# EAGLE schematic Sparki_Rev15 (EAGLE 6.4)

## Sheet 1 of 2
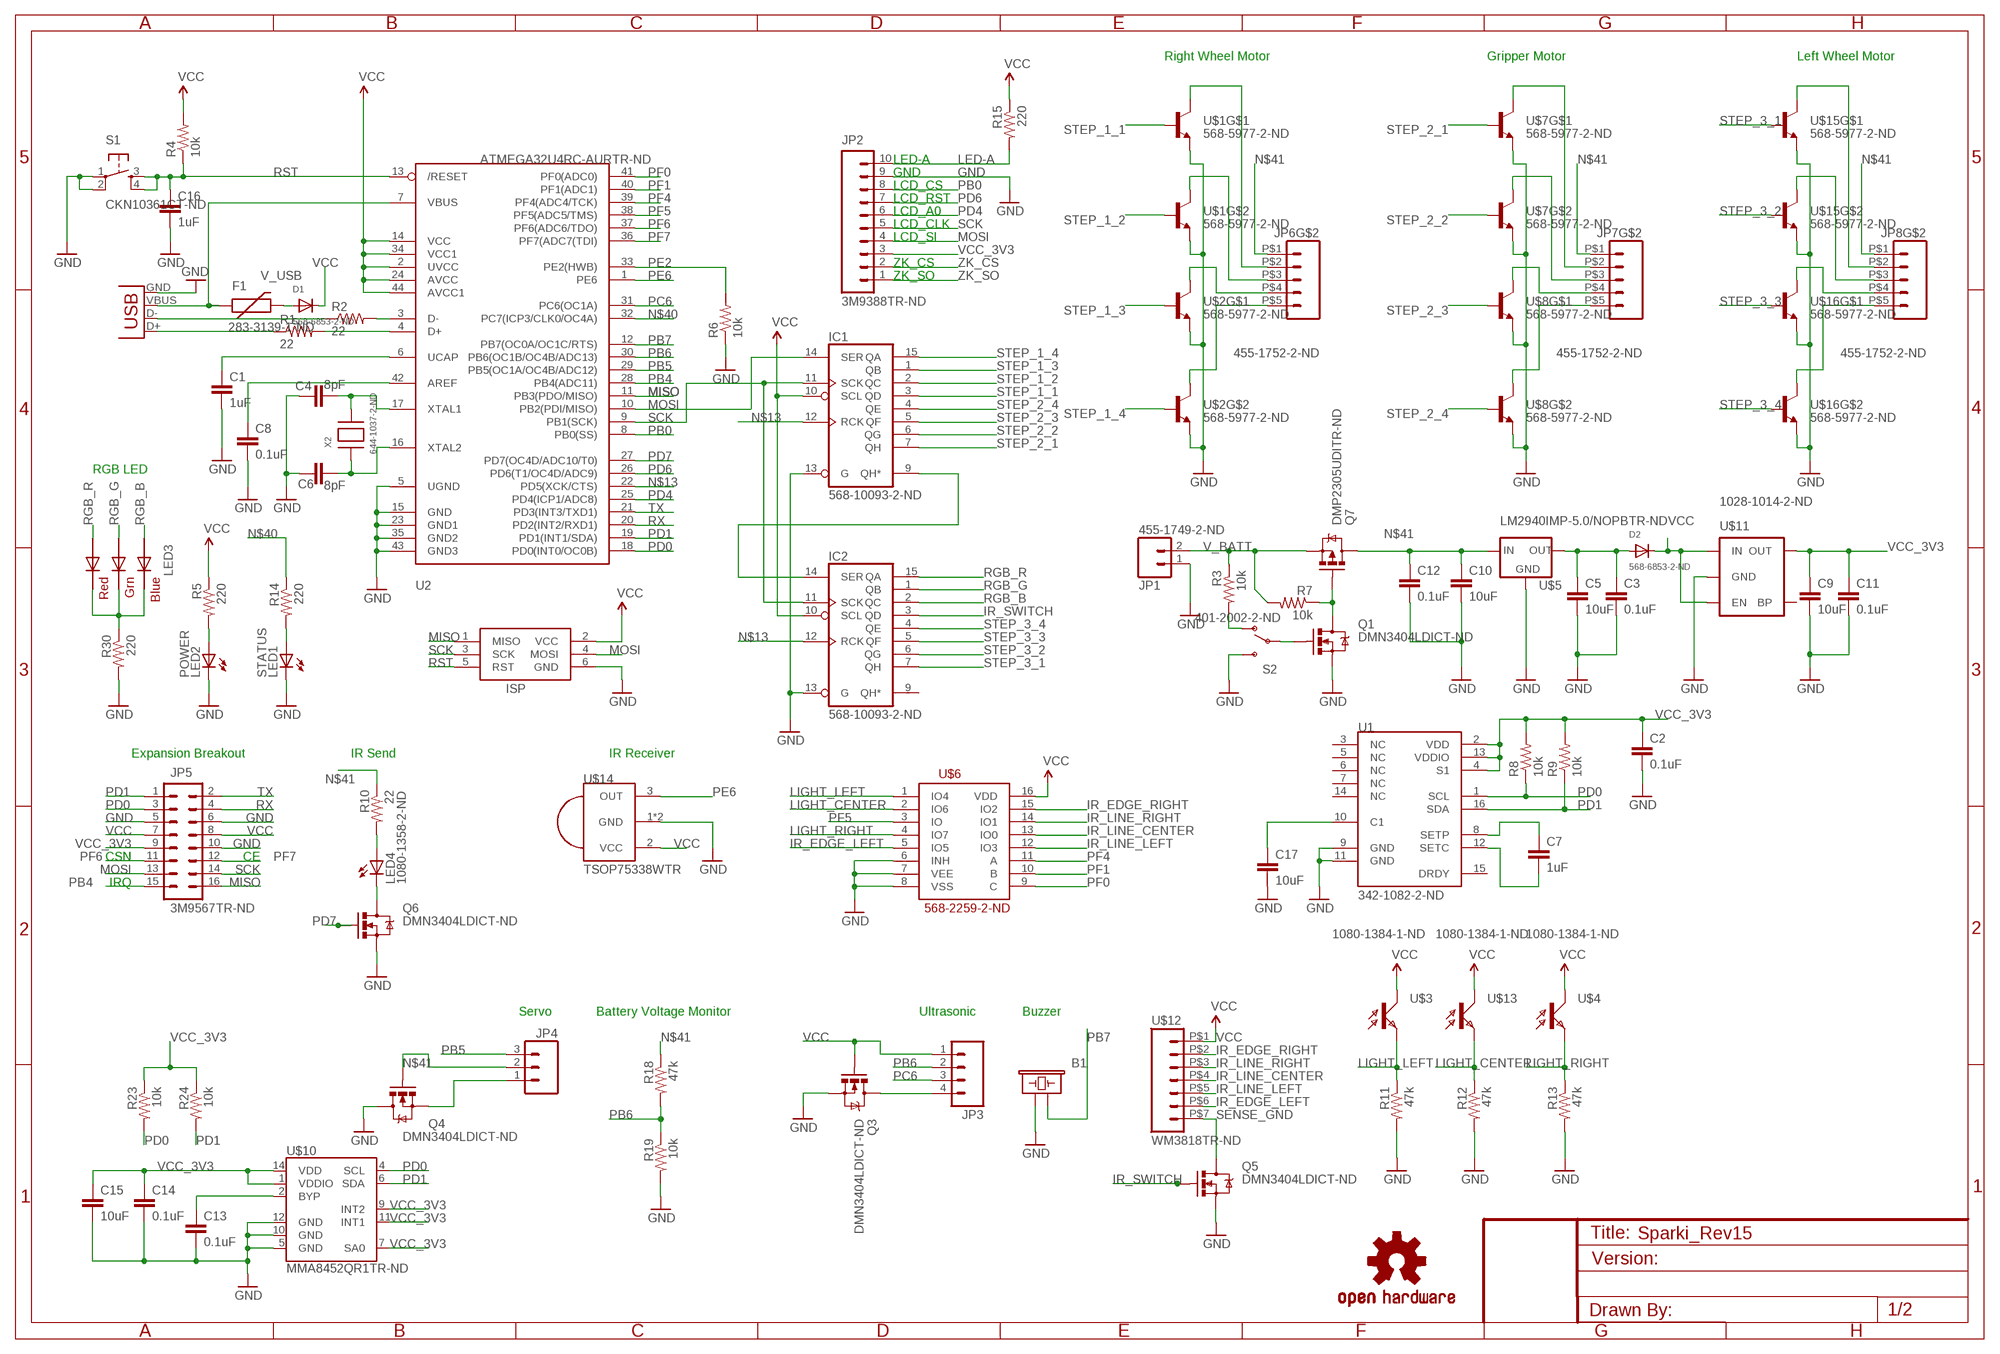
[diagram p0: schematic, sheet 1]

### Parts
B1  SMT-0927-T-2-R  BUZZERSMD2  [BUZZER-CCV]
C1  1uF  CAP0603-CAP  [0603-CAP]
C2  0.1uF  CAP0603-CAP  [0603-CAP]
C3  0.1uF  CAP0603-CAP  [0603-CAP]
C4  8pF  CAP0603-CAP  [0603-CAP]
C5  10uF  CAP0805  [0805]
C6  8pF  CAP0603-CAP  [0603-CAP]
C7  1uF  CAP0603-CAP  [0603-CAP]
C8  0.1uF  CAP0603-CAP  [0603-CAP]
C9  10uF  CAP0805  [0805]
C10  10uF  CAP0805  [0805]
C11  0.1uF  CAP0603-CAP  [0603-CAP]
C12  0.1uF  CAP0603-CAP  [0603-CAP]
C13  0.1uF  CAP0603-CAP  [0603-CAP]
C14  0.1uF  CAP0603-CAP  [0603-CAP]
C15  10uF  CAP0805  [0805]
C16  1uF  CAP0603-CAP  [0603-CAP]
C17  10uF  CAP0805  [0805]
D1  568-6853-2-ND  PMEG3010EP  [SOD-128]
D2  568-6853-2-ND  PMEG3010EP  [SOD-128]
F1  283-3139-1-ND  PTCSMD  [PTC-1206]
IC1  568-10093-2-ND  74595  [TSSOP16]
IC2  568-10093-2-ND  74595  [TSSOP16]
ISP  AVRISP-6  [AVRISP]
JP1  455-1749-2-ND  M02-JST-2MM-SMT  [JST-2-SMD]
JP2  3M9388TR-ND  M10  [1X10-2.54MM-SMD]
JP3  3M12031-ND  M04SMD3  [1X04-2.54MM-SMD]
JP4  M20-8900305-ND  M03SMD_RA_MALE  [1X03_SMD_RA_MALE]
JP5  3M9567TR-ND  M08X2SMD  [2X08-2.54MM-SMD]
JP6  455-1752-2-ND  JST-PH2.0-5P  [1X05-2.0MM-JST-PH]
JP7  455-1752-2-ND  JST-PH2.0-5P  [1X05-2.0MM-JST-PH]
JP8  455-1752-2-ND  JST-PH2.0-5P  [1X05-2.0MM-JST-PH]
LED1  STATUS  LEDSML0805  [SML0805]
LED2  POWER  LEDSML0805  [SML0805]
LED3  PLCC6RGBCT  RGBLED5050  [RGBLED5050]
LED4  1080-1358-2-ND  LED-FKIT-1206  [FKIT-LED-1206]
LOGO1  OSHW-LOGOM  [OSHW-LOGO-M]
Q1  DMN3404LDICT-ND  MOSFET-NCHANNELSMD  [SOT23-3]
Q3  DMN3404LDICT-ND  MOSFET-NCHANNELSMD  [SOT23-3]
Q4  DMN3404LDICT-ND  MOSFET-NCHANNELSMD  [SOT23-3]
Q5  DMN3404LDICT-ND  MOSFET-NCHANNELSMD  [SOT23-3]
Q6  DMN3404LDICT-ND  MOSFET-NCHANNELSMD  [SOT23-3]
Q7  DMP2305UDITR-ND  MOSFET-PCHANNELSMD  [SOT23-3]
R1  22  RESISTOR0603-RES  [0603-RES]
R2  22  RESISTOR0603-RES  [0603-RES]
R3  10k  RESISTOR0603-RES  [0603-RES]
R4  10k  RESISTOR0603-RES  [0603-RES]
R5  220  RESISTOR0603-RES  [0603-RES]
R6  10k  RESISTOR0603-RES  [0603-RES]
R7  10k  RESISTOR0603-RES  [0603-RES]
R8  10k  RESISTOR0603-RES  [0603-RES]
R9  10k  RESISTOR0603-RES  [0603-RES]
R10  22  RESISTOR0603-RES  [0603-RES]
R11  47k  RESISTOR0603-RES  [0603-RES]
R12  47k  RESISTOR0603-RES  [0603-RES]
R13  47k  RESISTOR0603-RES  [0603-RES]
R14  220  RESISTOR0603-RES  [0603-RES]
R15  220  RESISTOR0603-RES  [0603-RES]
R18  47k  RESISTOR0603-RES  [0603-RES]
R19  10k  RESISTOR0603-RES  [0603-RES]
R23  10k  RESISTOR0603-RES  [0603-RES]
R24  10k  RESISTOR0603-RES  [0603-RES]
R30  220  RESISTOR0603-RES  [0603-RES]
S1  CKN10361CT-ND  TAC_SWITCHSMD  [TACTILE_SWITCH_SMD]
S2  401-2002-2-ND  SWITCH-SPDTSMD  [AYZ0202]
U1  342-1082-2-ND  HMC5883LSMD  [16LPCC]
U2  ATMEGA32U4RC-AURTR-ND  ATMEGA32U4-AU  [TQFP44]
U$1  568-5977-2-ND  MMDT3904  [SOT363]
U$2  568-5977-2-ND  MMDT3904  [SOT363]
U$3  1080-1384-1-ND  PHOTOTRANSISTOR0402  [LED-0402]
U$4  1080-1384-1-ND  PHOTOTRANSISTOR0402  [LED-0402]
U$5  LM2940IMP-5.0/NOPBTR-ND  V_REG_MIC2920  [SOT223]
U$6  568-2259-2-ND  74HC4051_MUXTSSOP-16  [TSSOP-16]
U$7  568-5977-2-ND  MMDT3904  [SOT363]
U$8  568-5977-2-ND  MMDT3904  [SOT363]
U$10  MMA8452QR1TR-ND  MMA8452Q  [QFN-16_0.5MM]
U$11  1028-1014-2-ND  V_REG_LDOSMD  [SOT23-5]
U$12  WM3818TR-ND  FPC-1.0MM-7P  [1X07-1.0MM-FPC]
U$13  1080-1384-1-ND  PHOTOTRANSISTOR0402  [LED-0402]
U$14  TSOP75338WTR  TSOP75338  [TSOP75338]
U$15  568-5977-2-ND  MMDT3904  [SOT363]
U$16  568-5977-2-ND  MMDT3904  [SOT363]
X1  ED90342TR-ND  USBSMD  [USB-MINIB]
X2  644-1037-2-ND  XTALNX5032  [NX5032]

### Nets
ACCEL_BYP: C13.1 U$10.2(BYP)
D+: R1.2 U2.4(D+)
D-: R2.2 U2.3(D-)
GND: B1.- C1.2 C2.2 C3.2 C4.2 C5.2 C6.2 C8.2 C9.2 C10.2 C11.2 C12.2 C13.2 C14.2 C15.2 C16.2 C17.2 IC1.13(G) IC2.13(G) ISP.6(GND) JP1.1 JP2.9 JP5.5 JP5.6 JP5.10 LED1.C LED2.C Q1.2(S) Q3.2(S) Q4.3(D) Q5.2(S) Q6.2(S) R6.1 R11.2 R12.2 R13.2 R19.2 R30.2 S1.1 S1.2 S2.3(S) U1.9(GND) U1.11(GND) U2.5(UGND) U2.15(GND) U2.23(GND1) U2.35(GND2) U2.43(GND3) U$1.1(E) U$1.4(E) U$2.1(E) U$2.4(E) U$5.2(GND) U$6.6(INH) U$6.7(VEE) U$6.8(VSS) U$7.1(E) U$7.4(E) U$8.1(E) U$8.4(E) U$10.5(GND) U$10.10(GND) U$10.12(GND) U$11.2(GND) U$14.1(GND) U$14.4(GND) U$15.1(E) U$15.4(E) U$16.1(E) U$16.4(E) X1.GND
IR_EDGE_LEFT: U$6.5(IO5) U$12.P$6 ; also sheet 2
IR_EDGE_RIGHT: U$6.15(IO2) U$12.P$2 ; also sheet 2
IR_LINE_CENTER: U$6.13(IO0) U$12.P$4 ; also sheet 2
IR_LINE_LEFT: U$6.12(IO3) U$12.P$5 ; also sheet 2
IR_LINE_RIGHT: U$6.14(IO1) U$12.P$3 ; also sheet 2
IR_SWITCH: IC2.3(QD) Q5.1(G)
IRSEND: LED4.A R10.2
LED-A: JP2.10 R15.2
LIGHT_CENTER: R12.1 U$6.2(IO6) U$13.2(E)
LIGHT_LEFT: R11.1 U$3.2(E) U$6.1(IO4)
LIGHT_RIGHT: R13.1 U$4.2(E) U$6.4(IO7)
MISO: ISP.1(MISO) JP5.16 U2.11(PB3(PDO/MISO))
MOSI: IC1.14(SER) ISP.4(MOSI) JP2.4 JP5.13 U2.10(PB2(PDI/MISO))
N$2: LED2.A R5.2
N$3: JP7.P$2 U$7.3(C)
N$4: R2.1 X1.D-
N$5: R1.1 X1.D+
N$6: Q1.3(D) Q7.1(G) R7.1
N$7: JP6.P$5 U$2.6(C)
N$8: Q1.1(G) S2.2(P)
N$9: C3.1 C5.1 D2.P$2(A) U$5.3(OUT)
N$10: JP6.P$4 U$2.3(C)
N$12: JP6.P$3 U$1.6(C)
N$13: IC1.12(RCK) IC2.12(RCK) U2.22(PD5(XCK/CTS))
N$14: JP8.P$4 U$16.3(C)
N$15: JP8.P$3 U$15.6(C)
N$16: JP8.P$2 U$15.3(C)
N$17: IC1.9(QH*) IC2.14(SER)
N$18: LED4.C Q6.3(D)
N$19: LED1.A R14.2
N$20: C7.1 U1.8(SETP)
N$21: JP6.P$2 U$1.3(C)
N$23: JP3.4 Q3.3(D)
N$24: R3.2 S2.1(O)
N$25: JP4.1 Q4.2(S)
N$27: C7.2 U1.12(SETC)
N$28: C17.1 U1.10(C1)
N$29: C8.1 U2.42(AREF)
N$30: JP7.P$5 U$8.6(C)
N$31: JP7.P$4 U$8.3(C)
N$32: JP7.P$3 U$7.6(C)
N$40: R14.1 U2.32(PC7(ICP3/CLK0/OC4A))
N$41: C10.1 C12.1 JP4.2 JP6.P$1 JP7.P$1 JP8.P$1 Q4.1(G) Q7.3(D) R10.1 R18.1 U$5.1(IN)
N$42: LED3.4(BLUE_C) LED3.5(RED_C) LED3.6(GREEN_C) R30.1
N$44: JP8.P$5 U$16.6(C)
PB0: JP2.8 U2.8(PB0(SS))
PB4: JP5.15 U2.28(PB4(ADC11))
PB5: JP4.3 U2.29(PB5(OC1A/OC4B/ADC12))
PB6: JP3.2 R18.2 R19.1 U2.30(PB6(OC1B/OC4B/ADC13))
PB7: B1.+ U2.12(PB7(OC0A/OC1C/RTS))
PC6: JP3.3 U2.31(PC6(OC1A))
PD0: JP5.3 R8.1 R23.2 U1.1(SCL) U2.18(PD0(INT0/OC0B)) U$10.4(SCL)
PD1: JP5.1 R9.1 R24.2 U1.16(SDA) U2.19(PD1(INT1/SDA)) U$10.6(SDA)
PD4: JP2.6 U2.25(PD4(ICP1/ADC8))
PD6: JP2.7 U2.26(PD6(T1/OC4D/ADC9))
PD7: Q6.1(G) U2.27(PD7(OC4D/ADC10/T0))
PE2: R6.2 U2.33(PE2(HWB))
PE6: U2.1(PE6) U$14.3(OUT)
PF0: U2.41(PF0(ADC0)) U$6.9(C)
PF1: U2.40(PF1(ADC1)) U$6.10(B)
PF4: U2.39(PF4(ADC4/TCK)) U$6.11(A)
PF5: U2.38(PF5(ADC5/TMS)) U$6.3(IO)
PF6: JP5.11 U2.37(PF6(ADC6/TDO))
PF7: JP5.12 U2.36(PF7(ADC7(TDI))
RGB_B: IC2.2(QC) LED3.3(BLUE_A)
RGB_G: IC2.1(QB) LED3.1(GREEN_A)
RGB_R: IC2.15(QA) LED3.2(RED_A)
RST: C16.1 ISP.5(RST) R4.1 S1.3 S1.4 U2.13(/RESET)
RX: JP5.4 U2.20(PD2(INT2/RXD1))
SCK: IC1.11(SCK) IC2.11(SCK) ISP.3(SCK) JP2.5 JP5.14 U2.9(PB1(SCK))
SENSE_GND: Q5.3(D) U$12.P$7 ; also sheet 2
STEP_1_1: IC1.3(QD) U$1.5(B)
STEP_1_2: IC1.2(QC) U$1.2(B)
STEP_1_3: IC1.1(QB) U$2.5(B)
STEP_1_4: IC1.15(QA) U$2.2(B)
STEP_2_1: IC1.7(QH) U$7.5(B)
STEP_2_2: IC1.6(QG) U$7.2(B)
STEP_2_3: IC1.5(QF) U$8.5(B)
STEP_2_4: IC1.4(QE) U$8.2(B)
STEP_3_1: IC2.7(QH) U$15.5(B)
STEP_3_2: IC2.6(QG) U$15.2(B)
STEP_3_3: IC2.5(QF) U$16.5(B)
STEP_3_4: IC2.4(QE) U$16.2(B)
TX: JP5.2 U2.21(PD3(INT3/TXD1))
UCAP: C1.1 U2.6(UCAP)
V_BATT: JP1.2 Q7.2(S) R3.1 R7.2
V_USB: D1.P$2(A) F1.2
VBUS: F1.1 U2.7(VBUS) X1.VBUS
VCC: D1.P$1(C) D2.P$1(C) IC1.10(SCL) IC2.10(SCL) ISP.2(VCC) JP3.1 JP5.7 JP5.8 Q3.1(G) R4.2 R5.1 R15.1 U2.2(UVCC) U2.14(VCC) U2.24(AVCC) U2.34(VCC1) U2.44(AVCC1) U$3.1(C) U$4.1(C) U$6.16(VDD) U$11.1(IN) U$11.3(EN) U$12.P$1 U$13.1(C) U$14.2(VCC) ; also sheet 2
VCC_3V3: C2.1 C9.1 C11.1 C14.1 C15.1 JP2.3 JP5.9 R8.2 R9.2 R23.1 R24.1 U1.2(VDD) U1.4(S1) U1.13(VDDIO) U$10.1(VDDIO) U$10.7(SA0) U$10.9(INT2) U$10.11(INT1) U$10.14(VDD) U$11.5(OUT)
XTAL1: C4.1 U2.17(XTAL1) X2.P$2
XTAL2: C6.1 U2.16(XTAL2) X2.P$1
ZK_CS: JP2.2
ZK_SO: JP2.1
Unconnected: IC2.9(QH*) U1.3(NC) U1.5(NC) U1.6(NC) U1.7(NC) U1.14(NC) U1.15(DRDY) U$11.4(BP)

### Notes on the sheet
- Right Wheel Motor | Gripper Motor | Left Wheel Motor
- LED-A
- GND
- LCD_CS
- LCD_RST
- LCD_A0
- LCD_CLK
- LCD_SI
- ZK_CS
- ZK_SO
- RGB LED
- Expansion Breakout | IR Send | IR Receiver
- CSN | CE
- IRQ
- Servo | Battery Voltage Monitor | Ultrasonic | Buzzer

## Sheet 2 of 2
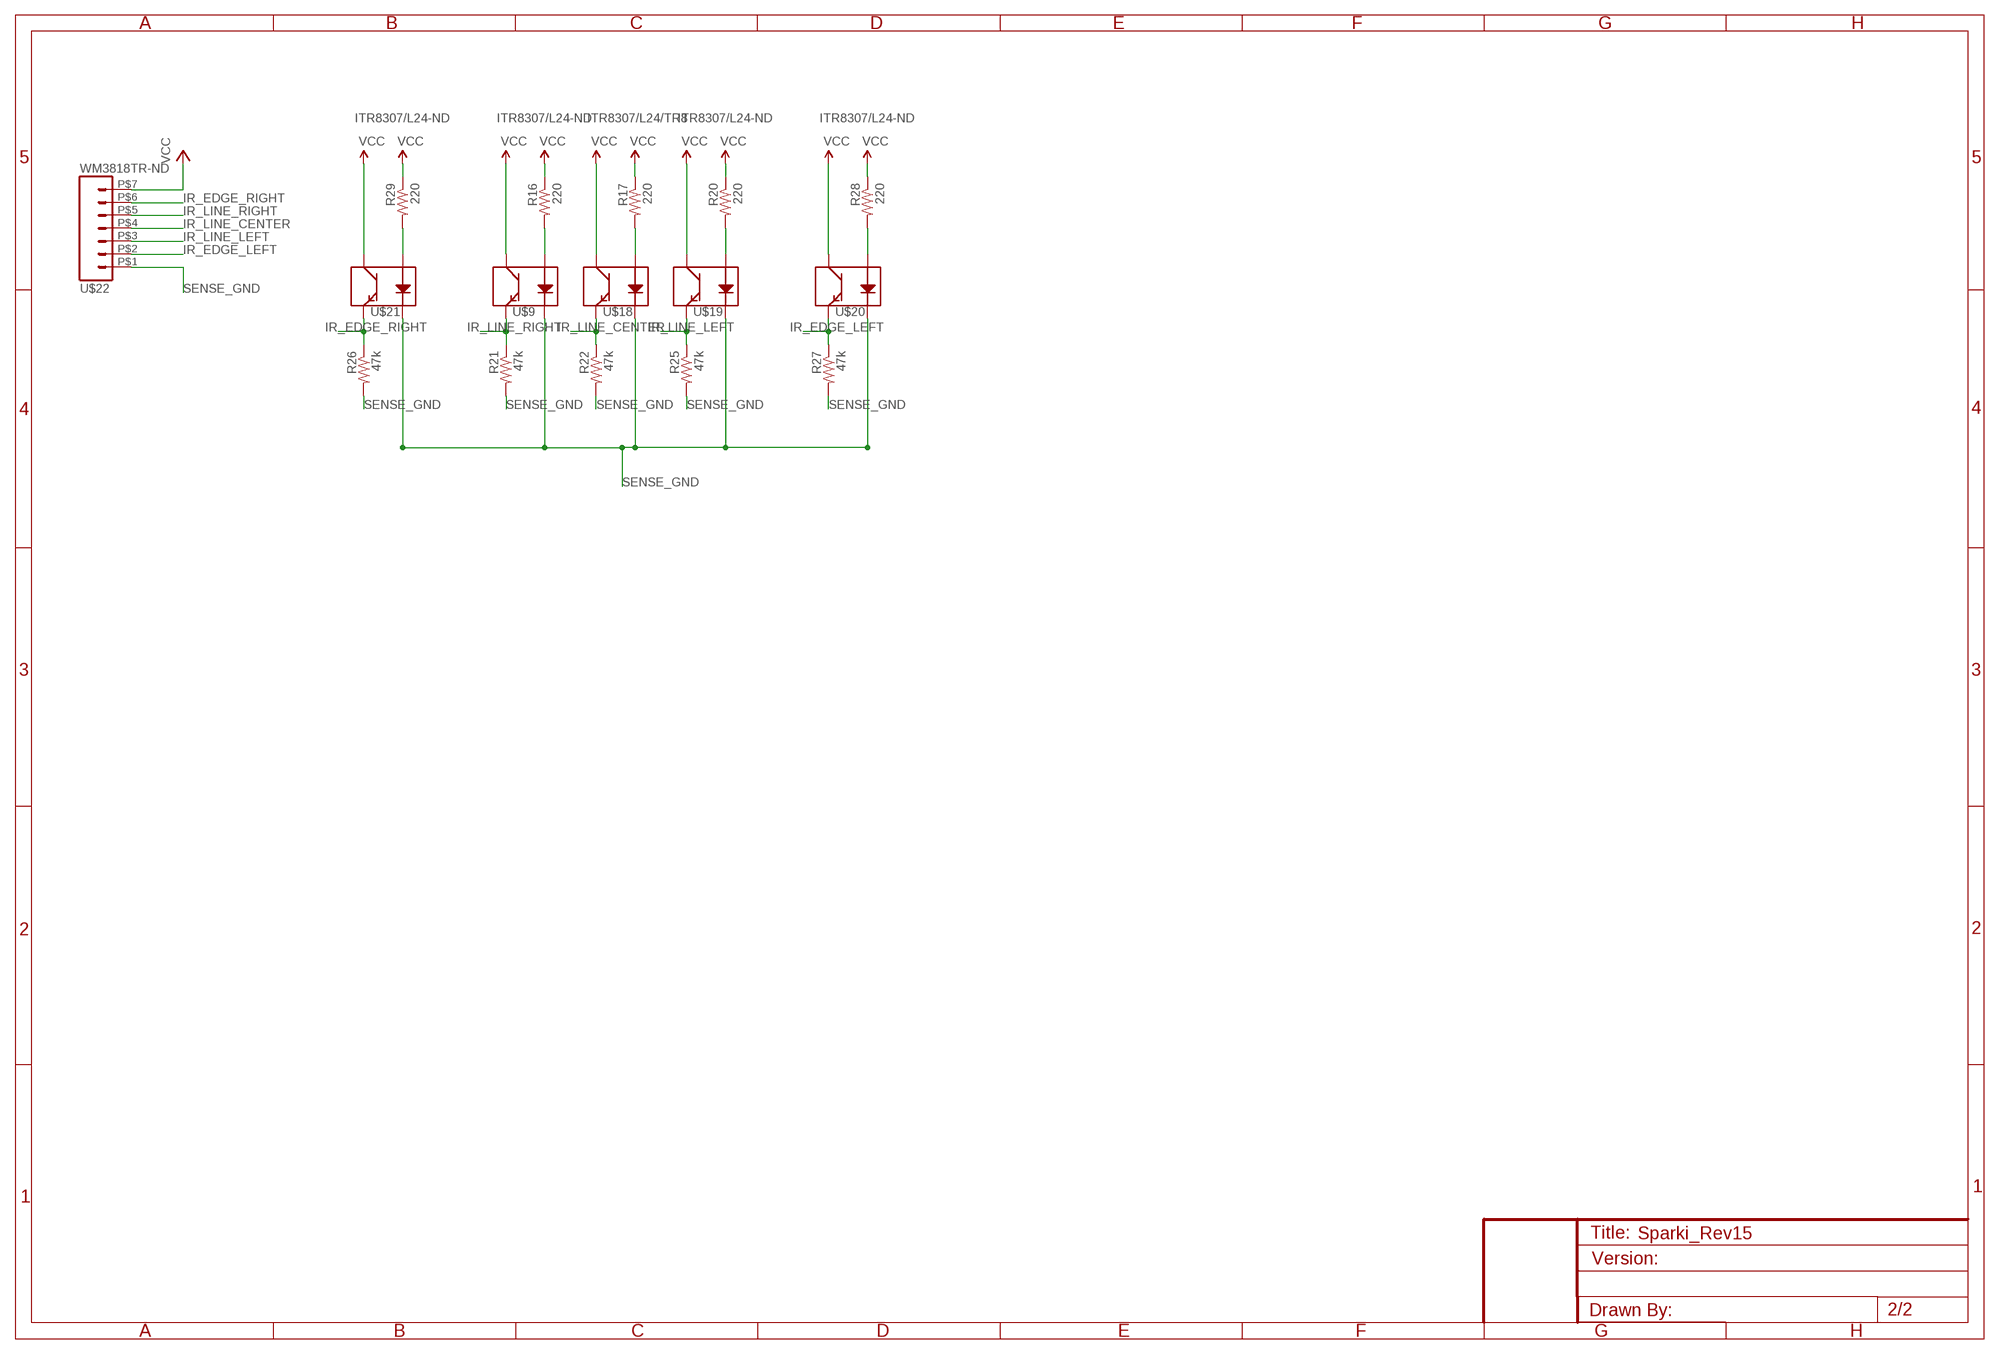
[diagram p1: schematic, sheet 2]

### Parts
R16  220  RESISTOR0603-RES  [0603-RES]
R17  220  RESISTOR0603-RES  [0603-RES]
R20  220  RESISTOR0603-RES  [0603-RES]
R21  47k  RESISTOR0603-RES  [0603-RES]
R22  47k  RESISTOR0603-RES  [0603-RES]
R25  47k  RESISTOR0603-RES  [0603-RES]
R26  47k  RESISTOR0603-RES  [0603-RES]
R27  47k  RESISTOR0603-RES  [0603-RES]
R28  220  RESISTOR0603-RES  [0603-RES]
R29  220  RESISTOR0603-RES  [0603-RES]
U$9  ITR8307/L24-ND  QRE1113  [QRE1113]
U$18  ITR8307/L24/TR8  QRE1113  [QRE1113]
U$19  ITR8307/L24-ND  QRE1113  [QRE1113]
U$20  ITR8307/L24-ND  QRE1113  [QRE1113]
U$21  ITR8307/L24-ND  QRE1113  [QRE1113]
U$22  WM3818TR-ND  FPC-1.0MM-7P  [1X07-1.0MM-FPC]

### Nets
IR_EDGE_LEFT: R27.1 U$20.4(E) U$22.P$2 ; also sheet 1
IR_EDGE_RIGHT: R26.1 U$21.4(E) U$22.P$6 ; also sheet 1
IR_LINE_CENTER: R22.1 U$18.4(E) U$22.P$4 ; also sheet 1
IR_LINE_LEFT: R25.1 U$19.4(E) U$22.P$3 ; also sheet 1
IR_LINE_RIGHT: R21.1 U$9.4(E) U$22.P$5 ; also sheet 1
LINEFLEDLEFT: R16.2 U$9.1(A)
LINEFLEDMID: R17.2 U$18.1(A)
LINEFLEDRIGHT: R20.2 U$19.1(A)
N$36: R28.2 U$20.1(A)
N$37: R29.2 U$21.1(A)
SENSE_GND: R21.2 R22.2 R25.2 R26.2 R27.2 U$9.2(K) U$18.2(K) U$19.2(K) U$20.2(K) U$21.2(K) U$22.P$1 ; also sheet 1
VCC: R16.1 R17.1 R20.1 R28.1 R29.1 U$9.3(C) U$18.3(C) U$19.3(C) U$20.3(C) U$21.3(C) U$22.P$7 ; also sheet 1

## Power pins joined to a net without a drawn wire
GND: IC1.8(GND) IC2.8(GND)
VCC: IC1.16(VCC) IC2.16(VCC)

## Library data of the parts
B1 = arcbotics:BUZZER: Buzzer 12mm Spark Fun Electronics SKU : Comp-Buzzer
C1 C3-C6 C8-C17 = SparkFun-Passives:CAP: Capacitor Standard 0603 ceramic capacitor, and 0.1" leaded capacitor.
C2 C7 = SparkFun-Capacitors:CAP: Capacitor Standard 0603 ceramic capacitor, and 0.1" leaded capacitor.
D1 D2 = arcbotics:PMEG3010EP
F1 = SparkFun:PTC: Resettable Fuse PTC Resettable Fuse. Spark Fun Electronics SKU : COM-08357
IC1 IC2 = arcbotics:74*595: 8-bit SHIFT REGISTER, output latch
ISP = adafruit:AVRISP: AVR ISP HEADER Standard 6 pin header for AVR programming
JP1 = SparkFun-Connectors:M02: Header 2 Standard 2-pin 0.1" header. Use with straight break away headers (SKU : PRT-00116), right angle break away headers (PRT-00553), swiss pins (PRT-00743), machine pins (PRT-00117), and female headers (PRT-00115). Molex polarized connector foot print use with SKU : PRT-08233 with associated crimp pins and housings.; PROD_ID: CONN-08352
JP2 = arcbotics:M10: Header 10 Standard 10-pin 0.1" header. Use with straight break away headers (SKU : PRT-00116), right angle break away headers (PRT-00553), swiss pins (PRT-00743), machine pins (PRT-00117), and female headers (PRT-00115).
JP3 = arcbotics:M04: Header 4 Standard 4-pin 0.1" header. Use with straight break away headers (SKU : PRT-00116), right angle break away headers (PRT-00553), swiss pins (PRT-00743), machine pins (PRT-00117), and female headers (PRT-00115). Molex polarized connector foot print use with SKU : PRT-08231 with associated crimp pins and housings. 1MM SMD Version SKU: PRT-10208
JP4 = SparkFun-Connectors:M03: Header 3 Standard 3-pin 0.1" header. Use with straight break away headers (SKU : PRT-00116), right angle break away headers (PRT-00553), swiss pins (PRT-00743), machine pins (PRT-00117), and female headers (PRT-00115). Molex polarized connector foot print use with SKU : PRT-08232 with associated crimp pins and housings.
JP5 = arcbotics:M08X2: .1" headers, two rows of 8 each
JP6-JP8 = arcbotics:JST-PH2.0-5P
LED1 LED2 = led:LED: LED OSRAM: - CHIPLED LG R971, LG N971, LY N971, LG Q971, LY Q971, LO R971, LY R971 LH N974, LH R974 LS Q976, LO Q976, LY Q976 LO Q996 - Hyper CHIPLED LW Q18S LB Q993, LB Q99A, LB R99A - SideLED LS A670, LO A670, LY A670, LG A670, LP A670 LB A673, LV A673, LT A673, LW A673 LH A674 LY A675 LS A676, LA A676, LO A676, LY A676, LW A676 LS A679, LY A679, LG A679 - Hyper Micro SIDELED® LS Y876, LA Y876, LO Y876, LY Y876 LT Y87S - SmartLED LW L88C, LW L88S LB L89C, LB L89S, LG L890 LS L89K, LO L89K, LY L89K LS L896, LA L896, LO L896, LY L896 - TOPLED LS T670, LO T670, LY T670, LG T670, LP T670 LSG T670, LSP T670, LSY T670, LOP T670, LYG T670 LG T671, LOG T671, LSG T671 LB T673, LV T673, LT T673, LW T673 LH T674 LS T676, LA T676, LO T676, LY T676, LB T676, LH T676, LSB T676, LW T676 LB T67C, LV T67C, LT T67C, LS T67K, LO T67K, LY T67K, LW E67C LS E67B, LA E67B, LO E67B, LY E67B, LB E67C, LV E67C, LT E67C LW T67C LS T679, LY T679, LG T679 LS T770, LO T770, LY T770, LG T770, LP T770 LB T773, LV T773, LT T773, LW T773 LH T774 LS E675, LA E675, LY E675, LS T675 LS T776, LA T776, LO T776, LY T776, LB T776 LHGB T686 LT T68C, LB T68C - Hyper Mini TOPLED® LB M676 - Mini TOPLED Santana® LG M470 LS M47K, LO M47K, LY M47K Source: http://www.osram.convergy.de LUXEON: - LUMILED® LXK2-PW12-R00, LXK2-PW12-S00, LXK2-PW14-U00, LXK2-PW14-V00 LXK2-PM12-R00, LXK2-PM12-S00, LXK2-PM14-U00 LXK2-PE12-Q00, LXK2-PE12-R00, LXK2-PE12-S00, LXK2-PE14-T00, LXK2-PE14-U00 LXK2-PB12-K00, LXK2-PB12-L00, LXK2-PB12-M00, LXK2-PB14-N00, LXK2-PB14-P00, LXK2-PB14-Q00 LXK2-PR12-L00, LXK2-PR12-M00, LXK2-PR14-Q00, LXK2-PR14-R00 LXK2-PD12-Q00, LXK2-PD12-R00, LXK2-PD12-S00 LXK2-PH12-R00, LXK2-PH12-S00 LXK2-PL12-P00, LXK2-PL12-Q00, LXK2-PL12-R00 Source: www.luxeon.com KINGBRIGHT: KA-3528ASYC Source: www.kingbright.com
LED3 = adafruit:RGBLED: For 5050 RGB LEDs, the order of the LEDs may vary from one manufacturer to another!
LED4 = arcbotics:LED: IR26-51C/L110/TR8 1A burstable IR Led, side-mounted in 1206 package
LOGO1 = SparkFun-Aesthetics:OSHW-LOGO: Open Source Hardware Logo This logo indicates the piece of hardware it is found on incorporates a OSHW license and/or adheres to the definition of open source hardware found here: http://freedomdefined.org/OSHW
Q1 Q3-Q6 = SparkFun-DiscreteSemi:MOSFET-NCHANNEL: Generic NMOS footprint
Q7 = SparkFun-DiscreteSemi:MOSFET-PCHANNEL: Generic PMOSFET
R1-R7 R10-R30 = SparkFun-Passives:RESISTOR: Resistor Basic schematic elements and footprints for 0603, 1206, and PTH resistors.
R8 R9 = SparkFun-Resistors:RESISTOR: Resistor Basic schematic elements and footprints for 0603, 1206, and PTH resistors.
S1 = SparkFun-Electromechanical:TAC_SWITCH: Momentary Switch Button commonly used for reset or general input. Spark Fun Electronics SKU : COM-00097 SMT- SWCH-08247; PROD_ID: SWCH-08247
S2 = SparkFun-Electromechanical:SWITCH-SPDT: SPDT Switch Simple slide switch, Spark Fun Electronics SKU : COM-00102 DPDT SMT slide switch, AYZ0202, SWCH-08179; PROD_ID: SWCH-08179
U1 = SparkFun:HMC5883L: 3 Axis Digital Compass IC
U2 = adafruit:ATMEGA32U4: http://www.ladyada.net/library/eagle
U$1 U$2 U$7 U$8 U$15 U$16 = SparkFun-DiscreteSemi:MMDT3904: Dual NPN transistor
U$3 U$4 U$13 = arcbotics:PHOTOTRANSISTOR: 0603 - PT19-21C/L41/TR8 - more geared towards infrared 1206 - EL-PT11 - spread between infrared and visible
U$5 = SparkFun-PowerIC:V_REG_MIC2920: MIC2920A (http://www.micrel.com/_PDF/mic2920.pdf) - 400mA output LDO Regulator
U$6 = arcbotics:74HC4051_MUX
U$9 U$18-U$21 = SparkFun-Sensors:QRE1113: Reflective object sensor
U$10 = SparkFun-Sensors:MMA8452Q: MMA8452Q 3-Axis, 12/8-bit Digital Accelerometer Supply Voltage: 1.6-3.6V Range: +/- 2g, 4g, 8g Interface: I2C, 12-bit and 8-bit ODR: 1.56 Hz - 800 Hz Package: QFN-16 http://cache.freescale.com/files/sensors/doc/data_sheet/MMA8452Q.pdf
U$11 = SparkFun:V_REG_LDO: Voltage Regulator LDO Standard 150mA LDO voltage regulator in SOT-23 layout. Micrel part MIC5205. BP (by-pass) pin is used to lower output noise with 470pF cap.
U$12 U$22 = arcbotics:FPC-1.0MM-7P
U$14 = arcbotics:TSOP75338
X1 = SparkFun-Connectors:USB: USB Connectors USB-B-PTH is fully proven SKU : PRT-00139 USB-miniB is fully proven SKU : PRT-00587 USB-A-PCB is untested. USB-A-H is throughly reviewed, but untested. Spark Fun Electronics SKU : PRT-00437 USB-B-SMT is throughly reviewed, but untested. Needs silkscreen touching up. USB-A-S has not been used/tested USB-MB-H has not been used/tested
X2 = adafruit:XTAL: Low cost SMT crystals, no capacitors included http://www.ladyada.net/library/eagle